# Altium schematic sheet Gastroscopy-Tool-Sensor_Connectors.SchDoc: Connectors
size 279 x 215 mm; Date: not used; ApprovedBy: not used; CheckedBy: not used; Author: not used; DrawnBy: not used; Organization: not used; Address4: not used; SheetNumber: 3; SheetTotal: 5; Time: not used; ImagePath: not used; Application_BuildNumber: not used
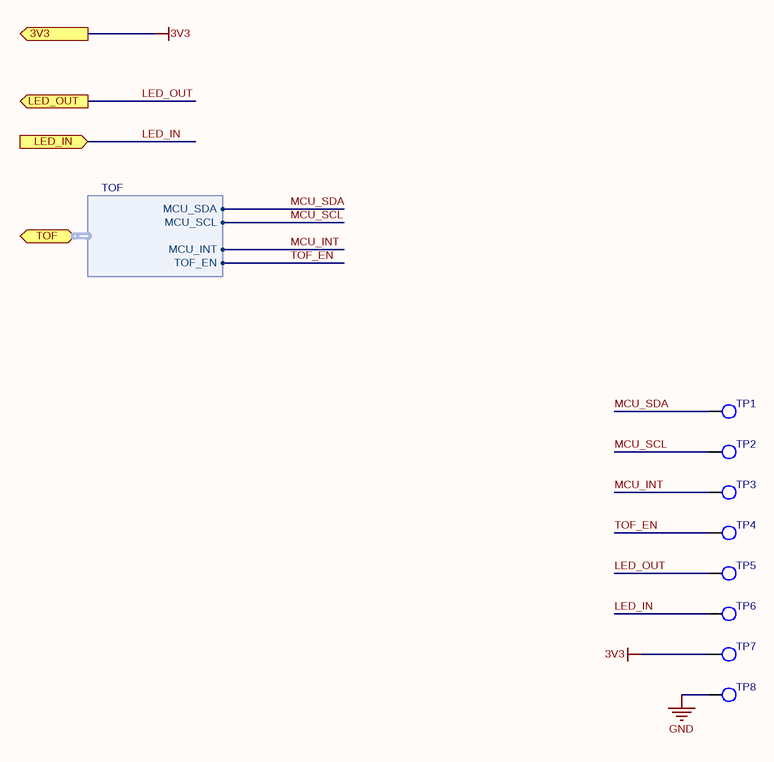
[diagram p0: Gastroscopy-Tool-Sensor_Connectors.SchDoc]

## Parts
TP1  TEST_POINT_SMT  [TEST_POINT_TH]  (value not drawn)  (no BOM)
TP2  TEST_POINT_SMT  [TEST_POINT_TH]  (value not drawn)  (no BOM)
TP3  TEST_POINT_SMT  [TEST_POINT_TH]  (value not drawn)  (no BOM)
TP4  TEST_POINT_SMT  [TEST_POINT_TH]  (value not drawn)  (no BOM)
TP5  TEST_POINT_SMT  [TEST_POINT_TH]  (value not drawn)  (no BOM)
TP6  TEST_POINT_SMT  [TEST_POINT_TH]  (value not drawn)  (no BOM)
TP7  TEST_POINT_SMT  [TEST_POINT_TH]  (value not drawn)  (no BOM)
TP8  TEST_POINT_SMT  [TEST_POINT_TH]  (value not drawn)  (no BOM)

## Ports
3V3 (out), LED_IN (in), LED_OUT (out), TOF (bidir, harness TOF)

## Harnesses
TOF: MCU_SDA, MCU_SCL, MCU_INT, TOF_EN

## Nets
3V3: TP7.1 ; port 3V3
GND: TP8.1
LED_IN: TP6.1 ; port LED_IN
LED_OUT: TP5.1 ; port LED_OUT
MCU_INT: TP3.1 ; port TOF.MCU_INT
MCU_SCL: TP2.1 ; port TOF.MCU_SCL
MCU_SDA: TP1.1 ; port TOF.MCU_SDA
TOF_EN: TP4.1 ; port TOF.TOF_EN

## Notes on the sheet
- Title:
- Date:
- Size A
- Project:
- Number:
- Time:
- Sheet
- Revision
- of
- Engineer:
- www.mrobots.ru <http://mrobots.ru/>
- File:

## Library data of the parts
TP1-TP8 = TEST_POINT_SMT: STM TEST POINT